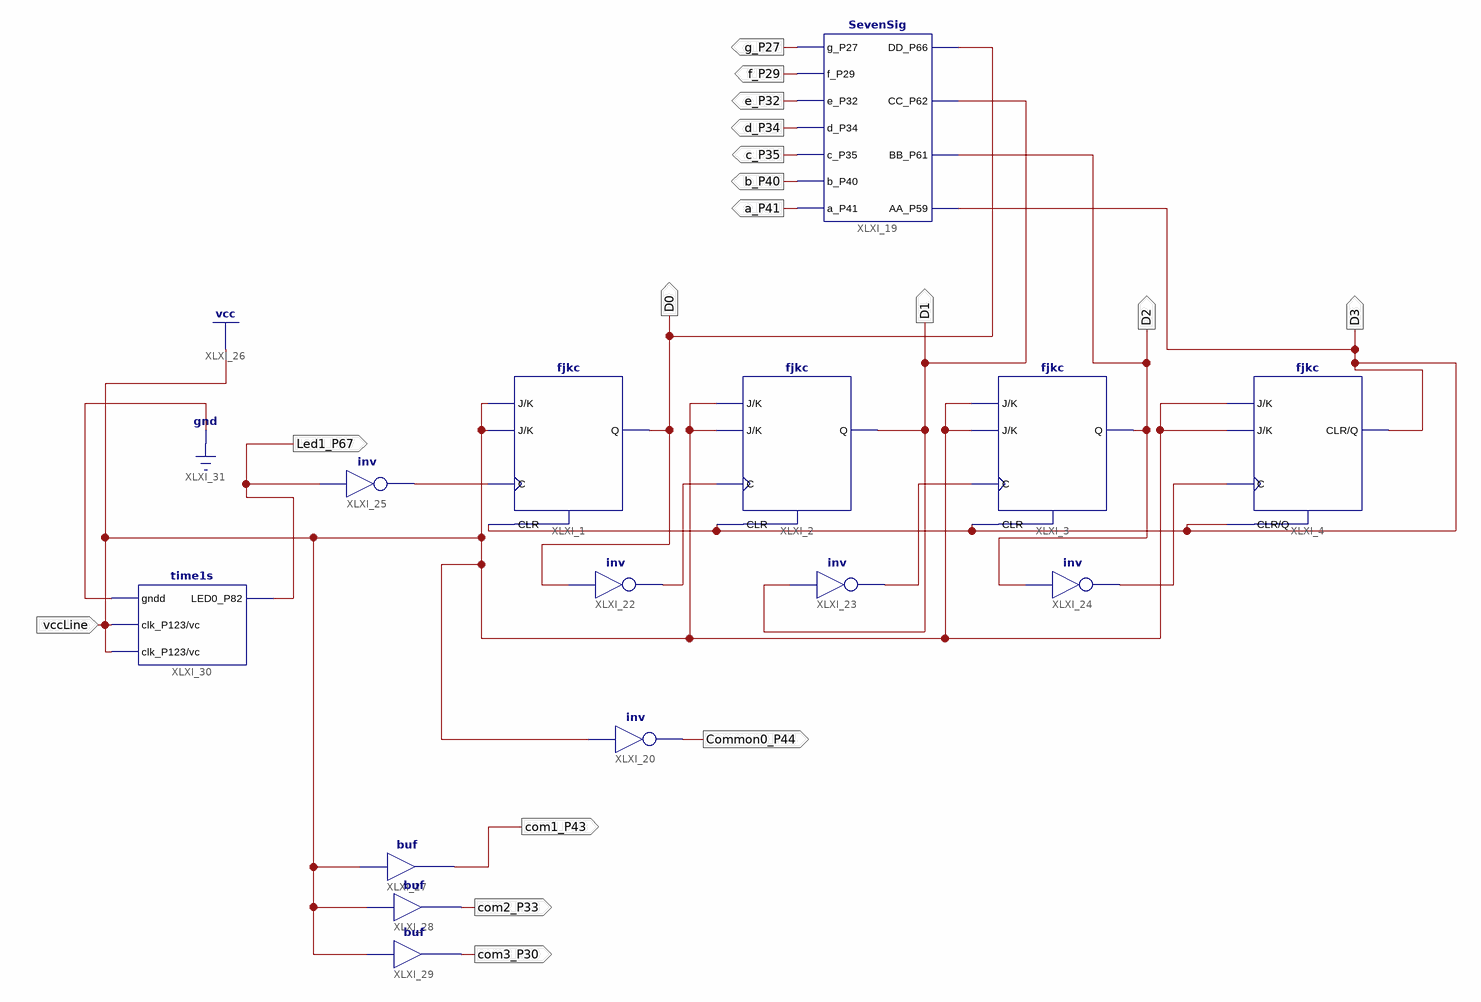
[diagram p0: schematic sheet 1]
// Xilinx ISE schematic Lab8_1.sch (spartan6) as structural Verilog: 14 symbols, 17 ports
module Lab8_1 (
  input  vccLine,
  output D0,
  output D1,
  output D2,
  output D3,
  output g_P27,
  output f_P29,
  output e_P32,
  output d_P34,
  output c_P35,
  output b_P40,
  output a_P41,
  output Common0_P44,
  output Led1_P67,
  output com1_P43,
  output com2_P33,
  output com3_P30
);

  wire XLXN_68, XLXN_70, XLXN_72, XLXN_74;

  fjkc XLXI_1 (.C(XLXN_74), .CLR(D3), .J(vccLine), .K(vccLine), .Q(D0));
  fjkc XLXI_2 (.C(XLXN_68), .CLR(D3), .J(vccLine), .K(vccLine), .Q(D1));
  fjkc XLXI_3 (.C(XLXN_70), .CLR(D3), .J(vccLine), .K(vccLine), .Q(D2));
  fjkc XLXI_4 (.C(XLXN_72), .CLR(D3), .J(vccLine), .K(vccLine), .Q(D3));
  SevenSig XLXI_19 (
    .AA_P59(D3), .BB_P61(D2), .CC_P62(D1), .DD_P66(D0), .a_P41(a_P41), .b_P40(b_P40), .c_P35(c_P35),
    .d_P34(d_P34), .e_P32(e_P32), .f_P29(f_P29), .g_P27(g_P27));
  not XLXI_20 (Common0_P44, vccLine);
  not XLXI_22 (XLXN_68, D0);
  not XLXI_23 (XLXN_70, D1);
  not XLXI_24 (XLXN_72, D2);
  not XLXI_25 (XLXN_74, Led1_P67);
  buf XLXI_27 (com1_P43, vccLine);
  buf XLXI_28 (com2_P33, vccLine);
  buf XLXI_29 (com3_P30, vccLine);
  time1s XLXI_30 (.gndd(1'b0), .clk_P123(vccLine), .vc(vccLine), .LED0_P82(Led1_P67));
  // also tied to VCC on the sheet: vccLine
endmodule
